# Altium schematic sheet Top_Sheet.SchDoc
size 420 x 297 mm; SheetNumber: 1; SheetTotal: 14
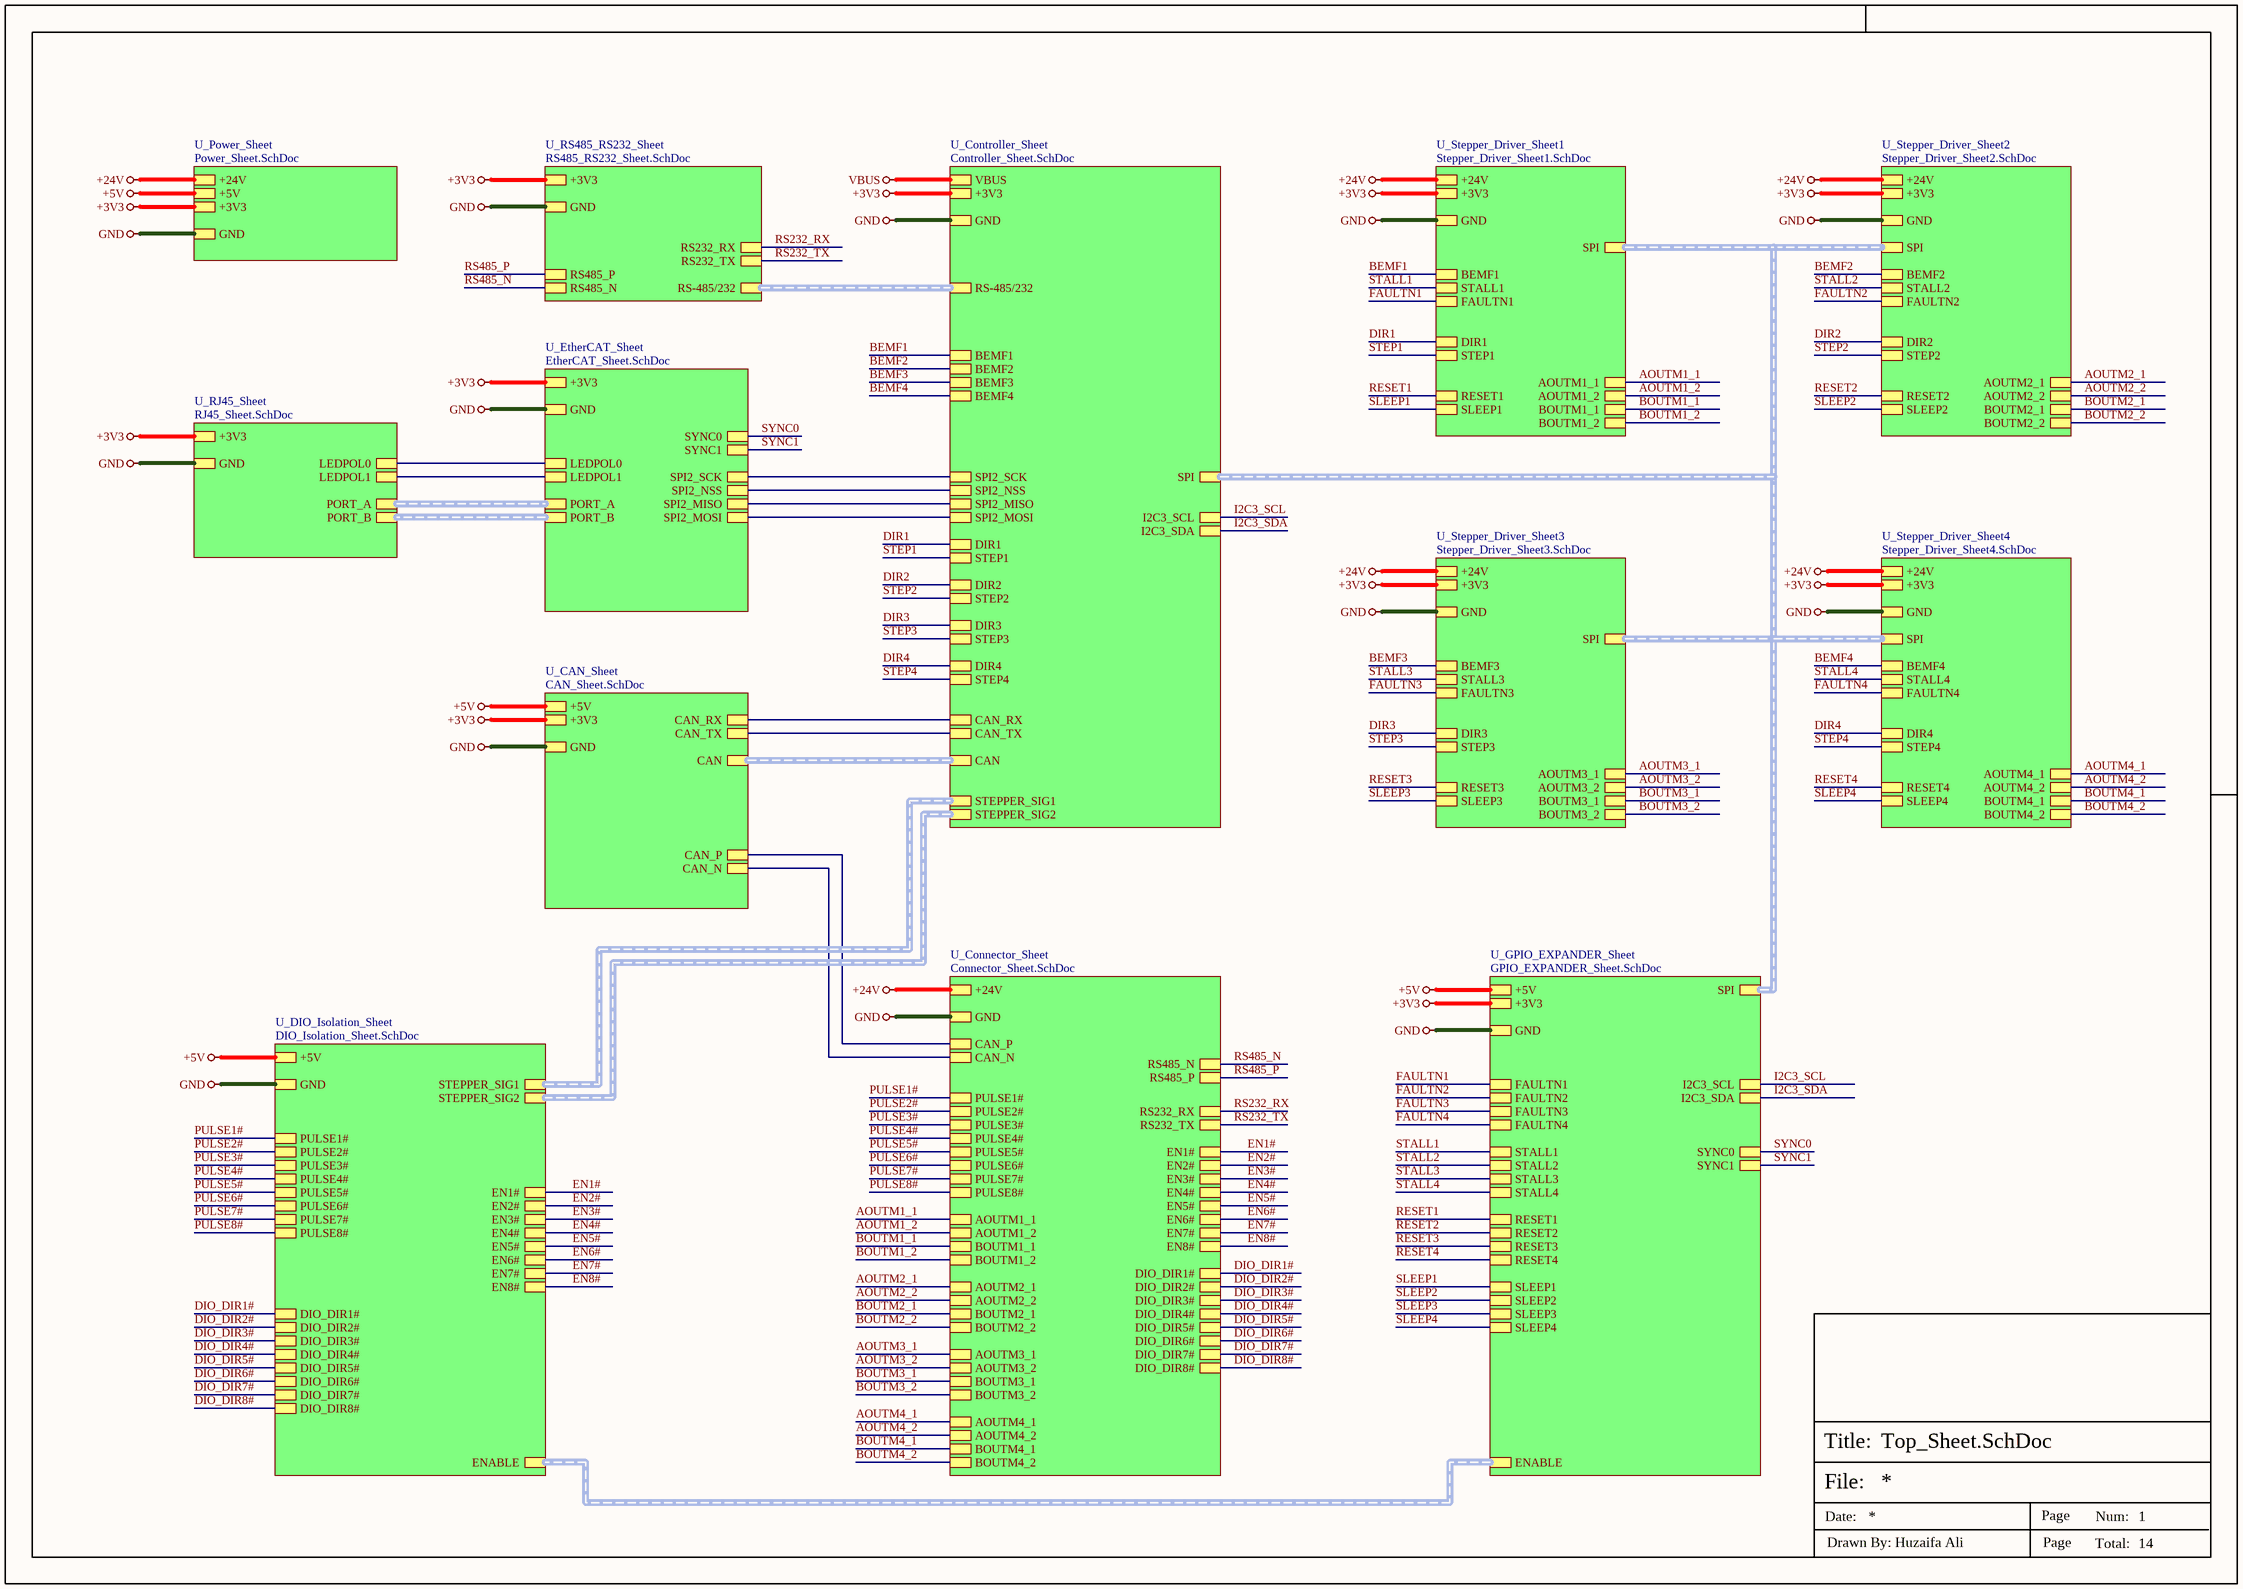
[diagram p0: Top_Sheet.SchDoc]

## Sub-sheets
U_CAN_Sheet = CAN_Sheet.SchDoc: CAN (harness CAN), CAN_RX, CAN_TX, CAN_P, CAN_N, +5V, +3V3, GND
U_Connector_Sheet = Connector_Sheet.SchDoc: RS485_N, RS485_P, RS232_RX, RS232_TX, CAN_P, CAN_N, AOUTM1_1, AOUTM1_2, BOUTM1_1, BOUTM1_2, AOUTM2_1, AOUTM2_2, BOUTM2_1, BOUTM2_2, AOUTM3_1, AOUTM3_2, BOUTM3_1, BOUTM3_2, AOUTM4_1, AOUTM4_2, BOUTM4_1, BOUTM4_2, +24V, GND, EN1#, EN2#, EN3#, EN4#, EN5#, EN6#, EN7#, EN8#, DIO_DIR1#, DIO_DIR2#, DIO_DIR3#, DIO_DIR4#, DIO_DIR5#, DIO_DIR6#, DIO_DIR7#, DIO_DIR8#, PULSE1#, PULSE2#, PULSE3#, PULSE4#, PULSE5#, PULSE6#, PULSE7#, PULSE8#
U_Controller_Sheet = Controller_Sheet.SchDoc: CAN (harness CAN), CAN_RX, CAN_TX, RS-485/232 (harness RS-485/232), VBUS, +3V3, GND, SPI2_SCK, SPI2_NSS, SPI2_MISO, SPI2_MOSI, STEPPER_SIG1 (harness STEPPER_SIG1), STEPPER_SIG2 (harness STEPPER_SIG2), BEMF1, BEMF2, BEMF3, BEMF4, SPI (harness SPI), DIR1, STEP2, DIR2, STEP3, DIR3, STEP4, DIR4, STEP1, I2C3_SCL, I2C3_SDA
U_DIO_Isolation_Sheet = DIO_Isolation_Sheet.SchDoc: +5V, GND, PULSE1#, PULSE2#, PULSE3#, PULSE4#, PULSE5#, PULSE6#, PULSE7#, PULSE8#, DIO_DIR1#, DIO_DIR2#, DIO_DIR3#, DIO_DIR4#, DIO_DIR5#, DIO_DIR6#, DIO_DIR7#, DIO_DIR8#, EN1#, EN2#, EN3#, EN4#, EN5#, EN6#, EN7#, EN8#, STEPPER_SIG1 (harness STEPPER_SIG1), STEPPER_SIG2 (harness STEPPER_SIG2), ENABLE (harness ENABLE)
U_EtherCAT_Sheet = EtherCAT_Sheet.SchDoc: PORT_A (harness PORT_A), PORT_B (harness PORT_B), LEDPOL0, LEDPOL1, SPI2_SCK, SPI2_NSS, SPI2_MISO, SPI2_MOSI, +3V3, GND, SYNC1, SYNC0
U_GPIO_EXPANDER_Sheet = GPIO_EXPANDER_Sheet.SchDoc: ENABLE (harness ENABLE), SPI (harness SPI), FAULTN1, FAULTN2, FAULTN3, FAULTN4, STALL1, STALL2, STALL3, STALL4, RESET1, RESET2, RESET3, RESET4, I2C3_SCL, I2C3_SDA, SLEEP4, SLEEP3, SLEEP2, SLEEP1, +5V, +3V3, GND, SYNC1, SYNC0
U_Power_Sheet = Power_Sheet.SchDoc: +24V, +5V, +3V3, GND
U_RJ45_Sheet = RJ45_Sheet.SchDoc: PORT_A (harness PORT_A), PORT_B (harness PORT_B), LEDPOL0, LEDPOL1, +3V3, GND
U_RS485_RS232_Sheet = RS485_RS232_Sheet.SchDoc: RS485_N, RS485_P, RS232_RX, RS232_TX, RS-485/232 (harness RS-485/232), +3V3, GND
U_Stepper_Driver_Sheet1 = Stepper_Driver_Sheet1.SchDoc: AOUTM1_1, AOUTM1_2, BOUTM1_1, BOUTM1_2, BEMF1, SPI (harness SPI), STALL1, FAULTN1, DIR1, STEP1, RESET1, SLEEP1, +24V, +3V3, GND
U_Stepper_Driver_Sheet2 = Stepper_Driver_Sheet2.SchDoc: AOUTM2_1, AOUTM2_2, BOUTM2_1, BOUTM2_2, SPI (harness SPI), BEMF2, STALL2, FAULTN2, DIR2, STEP2, RESET2, SLEEP2, +24V, +3V3, GND
U_Stepper_Driver_Sheet3 = Stepper_Driver_Sheet3.SchDoc: AOUTM3_1, AOUTM3_2, BOUTM3_1, BOUTM3_2, SPI (harness SPI), BEMF3, STALL3, FAULTN3, DIR3, STEP3, RESET3, SLEEP3, +24V, +3V3, GND
U_Stepper_Driver_Sheet4 = Stepper_Driver_Sheet4.SchDoc: AOUTM4_1, AOUTM4_2, BOUTM4_1, BOUTM4_2, SPI (harness SPI), BEMF4, STALL4, FAULTN4, DIR4, STEP4, RESET4, SLEEP4, +24V, +3V3, GND

## Nets
+3V3: sheet U_CAN_Sheet/+3V3, sheet U_Controller_Sheet/+3V3, sheet U_EtherCAT_Sheet/+3V3, sheet U_GPIO_EXPANDER_Sheet/+3V3, sheet U_Power_Sheet/+3V3, sheet U_RJ45_Sheet/+3V3, sheet U_RS485_RS232_Sheet/+3V3, sheet U_Stepper_Driver_Sheet1/+3V3, sheet U_Stepper_Driver_Sheet2/+3V3, sheet U_Stepper_Driver_Sheet3/+3V3, sheet U_Stepper_Driver_Sheet4/+3V3
+5V: sheet U_CAN_Sheet/+5V, sheet U_GPIO_EXPANDER_Sheet/+5V, sheet U_Power_Sheet/+5V, sheet U_DIO_Isolation_Sheet/+5V
+24V: sheet U_Connector_Sheet/+24V, sheet U_Power_Sheet/+24V, sheet U_Stepper_Driver_Sheet1/+24V, sheet U_Stepper_Driver_Sheet2/+24V, sheet U_Stepper_Driver_Sheet3/+24V, sheet U_Stepper_Driver_Sheet4/+24V
GND: sheet U_CAN_Sheet/GND, sheet U_Connector_Sheet/GND, sheet U_Controller_Sheet/GND, sheet U_EtherCAT_Sheet/GND, sheet U_GPIO_EXPANDER_Sheet/GND, sheet U_Power_Sheet/GND, sheet U_RJ45_Sheet/GND, sheet U_RS485_RS232_Sheet/GND, sheet U_Stepper_Driver_Sheet1/GND, sheet U_Stepper_Driver_Sheet2/GND, sheet U_Stepper_Driver_Sheet3/GND, sheet U_Stepper_Driver_Sheet4/GND, sheet U_DIO_Isolation_Sheet/GND
VBUS: sheet U_Controller_Sheet/VBUS
AOUTM1_1: sheet U_Connector_Sheet/AOUTM1_1, sheet U_Stepper_Driver_Sheet1/AOUTM1_1
AOUTM1_2: sheet U_Connector_Sheet/AOUTM1_2, sheet U_Stepper_Driver_Sheet1/AOUTM1_2
AOUTM2_1: sheet U_Connector_Sheet/AOUTM2_1, sheet U_Stepper_Driver_Sheet2/AOUTM2_1
AOUTM2_2: sheet U_Connector_Sheet/AOUTM2_2, sheet U_Stepper_Driver_Sheet2/AOUTM2_2
AOUTM3_1: sheet U_Connector_Sheet/AOUTM3_1, sheet U_Stepper_Driver_Sheet3/AOUTM3_1
AOUTM3_2: sheet U_Connector_Sheet/AOUTM3_2, sheet U_Stepper_Driver_Sheet3/AOUTM3_2
AOUTM4_1: sheet U_Connector_Sheet/AOUTM4_1, sheet U_Stepper_Driver_Sheet4/AOUTM4_1
AOUTM4_2: sheet U_Connector_Sheet/AOUTM4_2, sheet U_Stepper_Driver_Sheet4/AOUTM4_2
BEMF1: sheet U_Controller_Sheet/BEMF1, sheet U_Stepper_Driver_Sheet1/BEMF1
BEMF2: sheet U_Controller_Sheet/BEMF2, sheet U_Stepper_Driver_Sheet2/BEMF2
BEMF3: sheet U_Controller_Sheet/BEMF3, sheet U_Stepper_Driver_Sheet3/BEMF3
BEMF4: sheet U_Controller_Sheet/BEMF4, sheet U_Stepper_Driver_Sheet4/BEMF4
BOUTM1_1: sheet U_Connector_Sheet/BOUTM1_1, sheet U_Stepper_Driver_Sheet1/BOUTM1_1
BOUTM1_2: sheet U_Connector_Sheet/BOUTM1_2, sheet U_Stepper_Driver_Sheet1/BOUTM1_2
BOUTM2_1: sheet U_Connector_Sheet/BOUTM2_1, sheet U_Stepper_Driver_Sheet2/BOUTM2_1
BOUTM2_2: sheet U_Connector_Sheet/BOUTM2_2, sheet U_Stepper_Driver_Sheet2/BOUTM2_2
BOUTM3_1: sheet U_Connector_Sheet/BOUTM3_1, sheet U_Stepper_Driver_Sheet3/BOUTM3_1
BOUTM3_2: sheet U_Connector_Sheet/BOUTM3_2, sheet U_Stepper_Driver_Sheet3/BOUTM3_2
BOUTM4_1: sheet U_Connector_Sheet/BOUTM4_1, sheet U_Stepper_Driver_Sheet4/BOUTM4_1
BOUTM4_2: sheet U_Connector_Sheet/BOUTM4_2, sheet U_Stepper_Driver_Sheet4/BOUTM4_2
DIO_DIR1#: sheet U_Connector_Sheet/DIO_DIR1#, sheet U_DIO_Isolation_Sheet/DIO_DIR1#
DIO_DIR2#: sheet U_Connector_Sheet/DIO_DIR2#, sheet U_DIO_Isolation_Sheet/DIO_DIR2#
DIO_DIR3#: sheet U_Connector_Sheet/DIO_DIR3#, sheet U_DIO_Isolation_Sheet/DIO_DIR3#
DIO_DIR4#: sheet U_Connector_Sheet/DIO_DIR4#, sheet U_DIO_Isolation_Sheet/DIO_DIR4#
DIO_DIR5#: sheet U_Connector_Sheet/DIO_DIR5#, sheet U_DIO_Isolation_Sheet/DIO_DIR5#
DIO_DIR6#: sheet U_Connector_Sheet/DIO_DIR6#, sheet U_DIO_Isolation_Sheet/DIO_DIR6#
DIO_DIR7#: sheet U_Connector_Sheet/DIO_DIR7#, sheet U_DIO_Isolation_Sheet/DIO_DIR7#
DIO_DIR8#: sheet U_Connector_Sheet/DIO_DIR8#, sheet U_DIO_Isolation_Sheet/DIO_DIR8#
DIR1: sheet U_Controller_Sheet/DIR1, sheet U_Stepper_Driver_Sheet1/DIR1
DIR2: sheet U_Controller_Sheet/DIR2, sheet U_Stepper_Driver_Sheet2/DIR2
DIR3: sheet U_Controller_Sheet/DIR3, sheet U_Stepper_Driver_Sheet3/DIR3
DIR4: sheet U_Controller_Sheet/DIR4, sheet U_Stepper_Driver_Sheet4/DIR4
EN1#: sheet U_Connector_Sheet/EN1#, sheet U_DIO_Isolation_Sheet/EN1#
EN2#: sheet U_Connector_Sheet/EN2#, sheet U_DIO_Isolation_Sheet/EN2#
EN3#: sheet U_Connector_Sheet/EN3#, sheet U_DIO_Isolation_Sheet/EN3#
EN4#: sheet U_Connector_Sheet/EN4#, sheet U_DIO_Isolation_Sheet/EN4#
EN5#: sheet U_Connector_Sheet/EN5#, sheet U_DIO_Isolation_Sheet/EN5#
EN6#: sheet U_Connector_Sheet/EN6#, sheet U_DIO_Isolation_Sheet/EN6#
EN7#: sheet U_Connector_Sheet/EN7#, sheet U_DIO_Isolation_Sheet/EN7#
EN8#: sheet U_Connector_Sheet/EN8#, sheet U_DIO_Isolation_Sheet/EN8#
FAULTN1: sheet U_GPIO_EXPANDER_Sheet/FAULTN1, sheet U_Stepper_Driver_Sheet1/FAULTN1
FAULTN2: sheet U_GPIO_EXPANDER_Sheet/FAULTN2, sheet U_Stepper_Driver_Sheet2/FAULTN2
FAULTN3: sheet U_GPIO_EXPANDER_Sheet/FAULTN3, sheet U_Stepper_Driver_Sheet3/FAULTN3
FAULTN4: sheet U_GPIO_EXPANDER_Sheet/FAULTN4, sheet U_Stepper_Driver_Sheet4/FAULTN4
I2C3_SCL: sheet U_Controller_Sheet/I2C3_SCL, sheet U_GPIO_EXPANDER_Sheet/I2C3_SCL
I2C3_SDA: sheet U_Controller_Sheet/I2C3_SDA, sheet U_GPIO_EXPANDER_Sheet/I2C3_SDA
PULSE1#: sheet U_Connector_Sheet/PULSE1#, sheet U_DIO_Isolation_Sheet/PULSE1#
PULSE2#: sheet U_Connector_Sheet/PULSE2#, sheet U_DIO_Isolation_Sheet/PULSE2#
PULSE3#: sheet U_Connector_Sheet/PULSE3#, sheet U_DIO_Isolation_Sheet/PULSE3#
PULSE4#: sheet U_Connector_Sheet/PULSE4#, sheet U_DIO_Isolation_Sheet/PULSE4#
PULSE5#: sheet U_Connector_Sheet/PULSE5#, sheet U_DIO_Isolation_Sheet/PULSE5#
PULSE6#: sheet U_Connector_Sheet/PULSE6#, sheet U_DIO_Isolation_Sheet/PULSE6#
PULSE7#: sheet U_Connector_Sheet/PULSE7#, sheet U_DIO_Isolation_Sheet/PULSE7#
PULSE8#: sheet U_Connector_Sheet/PULSE8#, sheet U_DIO_Isolation_Sheet/PULSE8#
RESET1: sheet U_GPIO_EXPANDER_Sheet/RESET1, sheet U_Stepper_Driver_Sheet1/RESET1
RESET2: sheet U_GPIO_EXPANDER_Sheet/RESET2, sheet U_Stepper_Driver_Sheet2/RESET2
RESET3: sheet U_GPIO_EXPANDER_Sheet/RESET3, sheet U_Stepper_Driver_Sheet3/RESET3
RESET4: sheet U_GPIO_EXPANDER_Sheet/RESET4, sheet U_Stepper_Driver_Sheet4/RESET4
RS232_RX: sheet U_Connector_Sheet/RS232_RX, sheet U_RS485_RS232_Sheet/RS232_RX
RS232_TX: sheet U_Connector_Sheet/RS232_TX, sheet U_RS485_RS232_Sheet/RS232_TX
RS485_N: sheet U_Connector_Sheet/RS485_N, sheet U_RS485_RS232_Sheet/RS485_N
RS485_P: sheet U_Connector_Sheet/RS485_P, sheet U_RS485_RS232_Sheet/RS485_P
SLEEP1: sheet U_GPIO_EXPANDER_Sheet/SLEEP1, sheet U_Stepper_Driver_Sheet1/SLEEP1
SLEEP2: sheet U_GPIO_EXPANDER_Sheet/SLEEP2, sheet U_Stepper_Driver_Sheet2/SLEEP2
SLEEP3: sheet U_GPIO_EXPANDER_Sheet/SLEEP3, sheet U_Stepper_Driver_Sheet3/SLEEP3
SLEEP4: sheet U_GPIO_EXPANDER_Sheet/SLEEP4, sheet U_Stepper_Driver_Sheet4/SLEEP4
STALL1: sheet U_GPIO_EXPANDER_Sheet/STALL1, sheet U_Stepper_Driver_Sheet1/STALL1
STALL2: sheet U_GPIO_EXPANDER_Sheet/STALL2, sheet U_Stepper_Driver_Sheet2/STALL2
STALL3: sheet U_GPIO_EXPANDER_Sheet/STALL3, sheet U_Stepper_Driver_Sheet3/STALL3
STALL4: sheet U_GPIO_EXPANDER_Sheet/STALL4, sheet U_Stepper_Driver_Sheet4/STALL4
STEP1: sheet U_Controller_Sheet/STEP1, sheet U_Stepper_Driver_Sheet1/STEP1
STEP2: sheet U_Controller_Sheet/STEP2, sheet U_Stepper_Driver_Sheet2/STEP2
STEP3: sheet U_Controller_Sheet/STEP3, sheet U_Stepper_Driver_Sheet3/STEP3
STEP4: sheet U_Controller_Sheet/STEP4, sheet U_Stepper_Driver_Sheet4/STEP4
SYNC0: sheet U_EtherCAT_Sheet/SYNC0, sheet U_GPIO_EXPANDER_Sheet/SYNC0
SYNC1: sheet U_EtherCAT_Sheet/SYNC1, sheet U_GPIO_EXPANDER_Sheet/SYNC1
(unnamed): sheet U_CAN_Sheet/CAN_RX, sheet U_Controller_Sheet/CAN_RX
(unnamed): sheet U_CAN_Sheet/CAN_TX, sheet U_Controller_Sheet/CAN_TX
(unnamed): sheet U_CAN_Sheet/CAN_P, sheet U_Connector_Sheet/CAN_P
(unnamed): sheet U_CAN_Sheet/CAN_N, sheet U_Connector_Sheet/CAN_N
(unnamed): sheet U_Controller_Sheet/SPI2_SCK, sheet U_EtherCAT_Sheet/SPI2_SCK
(unnamed): sheet U_Controller_Sheet/SPI2_NSS, sheet U_EtherCAT_Sheet/SPI2_NSS
(unnamed): sheet U_Controller_Sheet/SPI2_MISO, sheet U_EtherCAT_Sheet/SPI2_MISO
(unnamed): sheet U_Controller_Sheet/SPI2_MOSI, sheet U_EtherCAT_Sheet/SPI2_MOSI
(unnamed): sheet U_EtherCAT_Sheet/LEDPOL0, sheet U_RJ45_Sheet/LEDPOL0
(unnamed): sheet U_EtherCAT_Sheet/LEDPOL1, sheet U_RJ45_Sheet/LEDPOL1

## Buses and harness runs
harness sheet U_CAN_Sheet/CAN = sheet U_Controller_Sheet/CAN
harness sheet U_Controller_Sheet/RS-485/232 = sheet U_RS485_RS232_Sheet/RS-485/232
harness sheet U_Controller_Sheet/SPI = sheet U_GPIO_EXPANDER_Sheet/SPI = sheet U_Stepper_Driver_Sheet1/SPI = sheet U_Stepper_Driver_Sheet2/SPI = sheet U_Stepper_Driver_Sheet3/SPI = sheet U_Stepper_Driver_Sheet4/SPI
harness sheet U_Controller_Sheet/STEPPER_SIG1 = sheet U_DIO_Isolation_Sheet/STEPPER_SIG1
harness sheet U_Controller_Sheet/STEPPER_SIG2 = sheet U_DIO_Isolation_Sheet/STEPPER_SIG2
harness sheet U_DIO_Isolation_Sheet/ENABLE = sheet U_GPIO_EXPANDER_Sheet/ENABLE
harness sheet U_EtherCAT_Sheet/PORT_A = sheet U_RJ45_Sheet/PORT_A
harness sheet U_EtherCAT_Sheet/PORT_B = sheet U_RJ45_Sheet/PORT_B

## Notes on the sheet
- File:
- Title:
- Date:
- Page
- Num:
- Total:
- Drawn By: Huzaifa Ali